# Altium schematic sheet USB3_Replication.SchDoc
size B; SheetNumber: 10; SheetTotal: 11
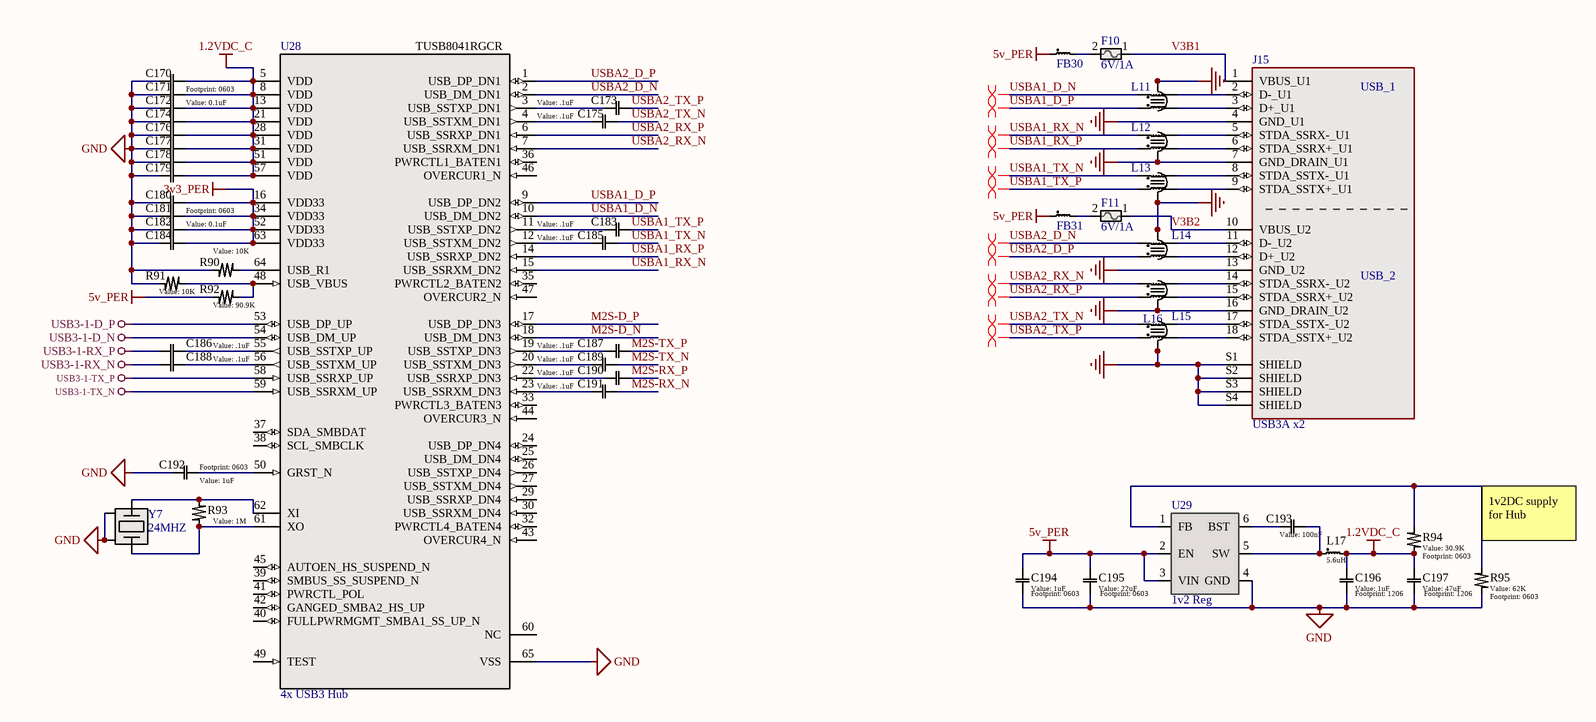
[diagram p0: USB3_Replication.SchDoc]

## Parts
C170  value 0.1uF  [0603]  (hidden comment: Generic Capacitor)
C171  Generic Capacitor  [0603]  (value not drawn)
C172  Generic Capacitor  [0603]  (value not drawn)
C173  value .1uF  [0603]  (hidden comment: Generic Capacitor)
C174  Generic Capacitor  [0603]  (value not drawn)
C175  value .1uF  [0603]  (hidden comment: Generic Capacitor)
C176  Generic Capacitor  [0603]  (value not drawn)
C177  Generic Capacitor  [0603]  (value not drawn)
C178  Generic Capacitor  [0603]  (value not drawn)
C179  Generic Capacitor  [0603]  (value not drawn)
C180  value 0.1uF  [0603]  (hidden comment: Generic Capacitor)
C181  Generic Capacitor  [0603]  (value not drawn)
C182  Generic Capacitor  [0603]  (value not drawn)
C183  value .1uF  [0603]  (hidden comment: Generic Capacitor)
C184  Generic Capacitor  [0603]  (value not drawn)
C185  value .1uF  [0603]  (hidden comment: Generic Capacitor)
C186  value .1uF  [0603]  (hidden comment: Generic Capacitor)
C187  value .1uF  [0603]  (hidden comment: Generic Capacitor)
C188  value .1uF  [0603]  (hidden comment: Generic Capacitor)
C189  value .1uF  [0603]  (hidden comment: Generic Capacitor)
C190  value .1uF  [0603]  (hidden comment: Generic Capacitor)
C191  value .1uF  [0603]  (hidden comment: Generic Capacitor)
C192  value 1uF  [0603]  (hidden comment: Generic Capacitor)
C193  value 100nF  [0603]  (hidden comment: Generic Capacitor)
C194  value 1uF  [0603]  (hidden comment: Generic Capacitor)
C195  value 22uF  [0603]  (hidden comment: Generic Capacitor)
C196  value 1uF  [1206]  (hidden comment: Generic Capacitor)
C197  value 47uF  [1206]  (hidden comment: Generic Capacitor)
F10  6V/1A  [0805]
F11  6V/1A  [0805]
FB30  0603 Ferrite  [0603]  (value not drawn)
FB31  0603 Ferrite  [0603]  (value not drawn)
J15  USB3A x2  [0484060003]
L11  2CH CMC  [SMD-6-2CH]  (value not drawn)
L12  2CH CMC  [SMD-6-2CH]  (value not drawn)
L13  2CH CMC  [SMD-6-2CH]  (value not drawn)
L14  2CH CMC  [SMD-6-2CH]  (value not drawn)
L15  2CH CMC  [SMD-6-2CH]  (value not drawn)
L16  2CH CMC  [SMD-6-2CH]  (value not drawn)
L17  5.6uH  [TMPC0402HP]
R90  value 10K  [0603]  (hidden comment: Generic Resistor)
R91  value 10K  [0603]  (hidden comment: Generic Resistor)
R92  value 90.9K  [0603]  (hidden comment: Generic Resistor)
R93  value 1M  [0603]  (hidden comment: Generic Resistor)
R94  value 30.9K  [0603]  (hidden comment: Generic Resistor)
R95  value 62K  [0603]  (hidden comment: Generic Resistor)
U28  4x USB3 Hub  [QFN-64]
U29  1v2 Reg  [TSOT-23-6]
Y7  24MHZ  [SMD2520-4P]

## Nets
1.2VDC_C: C170.1 C171.1 C172.1 C174.1 C176.1 C177.1 C178.1 C179.1 C196.1 C197.1 L17.2 R94.1 U28.5(VDD) U28.8(VDD) U28.13(VDD) U28.21(VDD) U28.28(VDD) U28.31(VDD) U28.51(VDD) U28.57(VDD)
3v3_PER: C180.1 C181.1 C182.1 C184.1 U28.16(VDD33) U28.34(VDD33) U28.52(VDD33) U28.63(VDD33)
5v_PER: C194.1 C195.1 FB30.1 FB31.1 R92.1 U29.2(EN) U29.3(VIN)
GND: C170.2 C171.2 C172.2 C174.2 C176.2 C177.2 C178.2 C179.2 C180.2 C181.2 C182.2 C184.2 C192.1 C194.2 C195.2 C196.2 C197.2 J15.4(GND_U1) J15.7(GND_DRAIN_U1) J15.13(GND_U2) J15.16(GND_DRAIN_U2) J15.S1(SHIELD) J15.S2(SHIELD) J15.S3(SHIELD) J15.S4(SHIELD) L11.5 L11.6 L12.5 L12.6 L13.5 L13.6 L14.5 L14.6 L15.5 L15.6 L16.5 L16.6 R90.1 R91.2 R95.1 U28.65(VSS) U29.4(GND) Y7.2(GND) Y7.4(GND)
USB3-1-D_N: U28.54(USB_DM_UP)
USB3-1-D_P: U28.53(USB_DP_UP)
USB3-1-RX_N: C188.2
USB3-1-RX_P: C186.2
USB3-1-TX_N: U28.59(USB_SSRXM_UP)
USB3-1-TX_P: U28.58(USB_SSRXP_UP)
M2S-D_N: U28.18(USB_DM_DN3)
M2S-D_P: U28.17(USB_DP_DN3)
M2S-RX_N: C191.2
M2S-RX_P: C190.2
M2S-TX_N: C189.2
M2S-TX_P: C187.2
USBA1_D_N: L11.2 U28.10(USB_DM_DN2)
USBA1_D_P: L11.1 U28.9(USB_DP_DN2)
USBA1_RX_N: L12.1 U28.15(USB_SSRXM_DN2)
USBA1_RX_P: L12.2 U28.14(USB_SSRXP_DN2)
USBA1_TX_N: C185.2 L13.1
USBA1_TX_P: C183.2 L13.2
USBA2_D_N: L14.2 U28.2(USB_DM_DN1)
USBA2_D_P: L14.1 U28.1(USB_DP_DN1)
USBA2_RX_N: L16.1 U28.7(USB_SSRXM_DN1)
USBA2_RX_P: L16.2 U28.6(USB_SSRXP_DN1)
USBA2_TX_N: C175.2 L15.1
USBA2_TX_P: C173.2 L15.2
V3B1: F10.1 J15.1(VBUS_U1)
V3B2: F11.1 J15.10(VBUS_U2)
NetC173_1: C173.1 U28.3(USB_SSTXP_DN1)
NetC175_1: C175.1 U28.4(USB_SSTXM_DN1)
NetC183_1: C183.1 U28.11(USB_SSTXP_DN2)
NetC185_1: C185.1 U28.12(USB_SSTXM_DN2)
NetC186_1: C186.1 U28.55(USB_SSTXP_UP)
NetC187_1: C187.1 U28.19(USB_SSTXP_DN3)
NetC188_1: C188.1 U28.56(USB_SSTXM_UP)
NetC189_1: C189.1 U28.20(USB_SSTXM_DN3)
NetC190_1: C190.1 U28.22(USB_SSRXP_DN3)
NetC191_1: C191.1 U28.23(USB_SSRXM_DN3)
NetC192_2: C192.2 U28.50(GRST_N)
NetC193_1: C193.1 U29.6(BST)
NetC193_2: C193.2 L17.1 U29.5(SW)
NetF10_2: F10.2 FB30.2
NetF11_2: F11.2 FB31.2
NetJ15_2: J15.2(D-_U1) L11.3
NetJ15_3: J15.3(D+_U1) L11.4
NetJ15_5: J15.5(STDA_SSRX-_U1) L12.4
NetJ15_6: J15.6(STDA_SSRX+_U1) L12.3
NetJ15_8: J15.8(STDA_SSTX-_U1) L13.4
NetJ15_9: J15.9(STDA_SSTX+_U1) L13.3
NetJ15_11: J15.11(D-_U2) L14.3
NetJ15_12: J15.12(D+_U2) L14.4
NetJ15_14: J15.14(STDA_SSRX-_U2) L16.4
NetJ15_15: J15.15(STDA_SSRX+_U2) L16.3
NetJ15_17: J15.17(STDA_SSTX-_U2) L15.4
NetJ15_18: J15.18(STDA_SSTX+_U2) L15.3
NetR90_2: R90.2 U28.64(USB_R1)
NetR91_1: R91.1 R92.2 U28.48(USB_VBUS)
NetR93_1: R93.1 U28.62(XI) Y7.1
NetR93_2: R93.2 U28.61(XO) Y7.3
NetR94_2: R94.2 R95.2 U29.1(FB)

Not connected (* = marked no-connect by the designer): U28 24(USB_DP_DN4) 25(USB_DM_DN4) 26(USB_SSTXP_DN4) 27(USB_SSTXM_DN4) 29(USB_SSRXP_DN4) 30(USB_SSRXM_DN4) 32(PWRCTL4_BATEN4) 33(PWRCTL3_BATEN3) 35(PWRCTL2_BATEN2) 36(PWRCTL1_BATEN1) 37(SDA_SMBDAT) 38(SCL_SMBCLK) 39(SMBUS_SS_SUSPEND_N) 40(FULLPWRMGMT_SMBA1_SS_UP_N) 41(PWRCTL_POL) 42(GANGED_SMBA2_HS_UP) 43(OVERCUR4_N) 44(OVERCUR3_N) 45(AUTOEN_HS_SUSPEND_N) 46(OVERCUR1_N) 47(OVERCUR2_N) 49(TEST) 60(NC)

## Layout directives
differential pair: USBA1_D_N, USBA1_D_P, USBA1_RX_N, USBA1_RX_P, USBA1_TX_N, USBA1_TX_P, USBA2_D_N, USBA2_D_P, USBA2_RX_N, USBA2_RX_P, USBA2_TX_N, USBA2_TX_P

## Notes on the sheet
- (near R95) 1v2DC supply for Hub
- REV
- REVISIONS
- DATE
- DESCRIPTION
- BY
- UNLESS OTHERWISE SPECIFIED, DRAWING DEFINITIONS AND TOLERANCES SHALL BE FOUND UNDER SUPPLIER STANDARDS SS-001. THIS PART AND ALL COMPONENTS OF IT MUST BE RoHS & REACH COMPLIANT. A CERTIFICATE OF COMPLIANCE MUST BE PROVIDED UPON REQUEST.
- ALL INFORMATION ON THIS DOCUMENT IS THE SOLE PROPERTY OF GAMBER-JOHNSON AND SHALL NOT BE COPIED, REPRODUCED, USED OR DISCLOSED IN WHOLE OR IN PART WITHOUT THE WRITTEN CONSENT OF GAMBER-JOHNSON
- TOLERANCES
  .00 ± .060
  .000 ± .020
  .0000 ± .005
  ANGELS ± 1°
- DRAWN BY:
- PROJECT NUMBER:
- SHEET TITLE:
- SHEET
- OF
- DATE:
- LOCATION:
- ASSEMBLY NUMBER
- SIZE
- GAMBER-JOHNSON LLC
  5001 JOERNS DR.
  STEVENS POINT, WI 54481
  +1 (715) 344-5209
- B
- (in symbol 0484060003) USB_1; USB_2

## Library data of the parts
C170 C180 = Generic Capacitor: Voltage: 10V; Tolerance: 10%
C171 C172 C174 C176-C179 C181 C182 C184 = Generic Capacitor: Voltage: 10V; Tolerance: 10%; Value: 0.1uF
C173 C175 C183 C185-C197 = Generic Capacitor: Voltage: >10V; Tolerance: 10%
F10 F11 = 0ZCK0100FF2E: Polymeric PTC Resettable Fuse 6V 1 A Ih Surface Mount 0805 (2012 Metric), Concave; Manufacturer: Bel; Max Current Rating: 40A; Hold Current: 1A; Trip Current: 1.95A; Time to Trip: 0.3s; Supplier 1: Digi-Key; Supplier Part Number 1: 507-1815-1-ND; Manufacturer Part Number: 0ZCK0100FF2E; RoHS: Yes; Category: PTC Resettable Fuses; Stock 1: 74738; Pricing 1: 1=0.27000, 5=0.26600, 10=0.25400, 50=0.22620, 100=0.21060, 250=0.18720, 500=0.15600, 1000=0.14820 (USD); Mount: Surface Mount; Case/Package: 0805; Case Code (Metric): 2012; Case Code (Imperial): 0805; Contact Plating: Tin,Matte; Min Operating Temperature: -40°C; Max Operating Temperature: 85°C; Package Quantity: 1; Packaging: Tape and Reel; RoHS Compliant: Yes; ComponentLink1URL: https://datasheet.ciiva.com/18550/0zck-18550620.pdf?src-supplier=Digi-Key; ComponentLink1Description: https://datasheet.ciiva.com/18550/0zck-18550620.pdf?src-supplier=Digi-Key; ComponentLink2URL: https://datasheet.ciiva.com/18550/0zck-18550621.pdf?src-supplier=Digi-Key; ComponentLink2Description: https://datasheet.ciiva.com/18550/0zck-18550621.pdf?src-supplier=Digi-Key; ComponentLink3URL: https://datasheet.ciiva.com/18550/0zck-18550622.pdf?src-supplier=Digi-Key; ComponentLink3Description: https://datasheet.ciiva.com/18550/0zck-18550622.pdf?src-supplier=Digi-Key; LCSC PN: C883112
FB30 FB31 = PE-0603FB121ST: 120 Ohms @ 100 MHz 1 Signal Line Ferrite Bead 0603 (1608 Metric) 500mA 180mOhm; Manufacturer: Pulse; Number of Lines: 1; DC Resistance (DCR): 180mR; Supplier 1: Digi-Key; Supplier Part Number 1: 553-2382-1-ND; Manufacturer Part Number: PE-0603FB121ST; RoHS: Yes; Category: Inductors; Stock 1: 6181; Pricing 1: 1=0.10000, 10=0.04400, 25=0.03920, 50=0.03580, 100=0.03220, 250=0.02360, 500=0.01716, 1000=0.01680 (USD); Mount: Surface Mount; Case/Package: 0603; Case Code (Metric): 1608; Case Code (Imperial): 0603; Min Operating Temperature: -40°C; Max Operating Temperature: 105°C; Package Quantity: 4000; Packaging: Tape and Reel; Max Current Rating: 500mA; Length: 0.063inch; Width: 0.031inch; Height: 0.037inch; RoHS Compliant: Yes; ComponentLink1URL: https://productfinder.pulseeng.com/doc_type/WEB301/doc_num/WC706/doc_part/WC706.pdf?src-supplier=Digi-Key; ComponentLink1Description: https://productfinder.pulseeng.com/doc_type/WEB301/doc_num/WC706/doc_part/WC706.pdf?src-supplier=Digi-Key; ComponentLink2URL: http://productfinder.pulseeng.com/products/datasheets/WC706.pdf?src-supplier=Digi-Key; ComponentLink2Description: http://productfinder.pulseeng.com/products/datasheets/WC706.pdf?src-supplier=Digi-Key; LCSC PN: C275486
J15 = 0484060003: USB-A _USB TYPE-A_, Stacked USB 3.0 _USB 3.1 Gen 1, Superspeed_ Receptacle Connector 18 Position Through Hole, Right Angle; MF: Molex; Package: None; MP: 0484060003; Price: None; Availability: Unavailable; Value: *; SnapEDA_Link: https://www.snapeda.com/parts/0484060003/Molex/view-part/424547/?ref=snap; LCSC PN: C2895028
L11-L16 = ICMEF112P350MFR: 35Ω@100MHz -40℃~+85℃ 4Ω 5V 2 100mA SMD Common Mode Filters ROHS; LCSC PN: C396460; Supplier 1: Mouser; Supplier Part Number 1: 710-748020024
L17 = TMPC0402HP-5R6MG-Z02: 2A 5.6uH ±20% SMD Power Inductor; LCSC PN: C357137; Supplier 1: Digi-Key; Supplier Part Number 1: 732-3339-1-ND
R90-R95 = Generic Resistor: Tolerance: 1%; Power: 1/10W
U28 = TUSB8041RGCR: USB Hub Controller USB 3.0 USB, GPIO, I2C, SMBus Interface 64-VQFN (9x9); Mfr_Name: Texas Instruments; Alternate_PartNumber: TUSB8041RGCT; CompType: IC; TYPE: TYPE; RefDes: RefDes; Application_BuildNumber: *; PartNumber: TUSB8041RGCR; PackageReference: RGC0064G; MountType: SMT; RoHS: Y; Manufacturer: Texas Instruments; LCSC PN: C486066
U29 = AP63201WU-7: Step-down type Adjustable 2A 1.2V~12V 3.8V~32V TSOT-23-6 DC-DC Converter; LCSC PN: C2071044; Supplier 1: Future Electronics; Supplier Part Number 1: 5109504
Y7 = CM4024M00020001: 24MHz 20pF ±10ppm ±30ppm SMD-2520-4P Crystals ROHS; LCSC PN: C284163